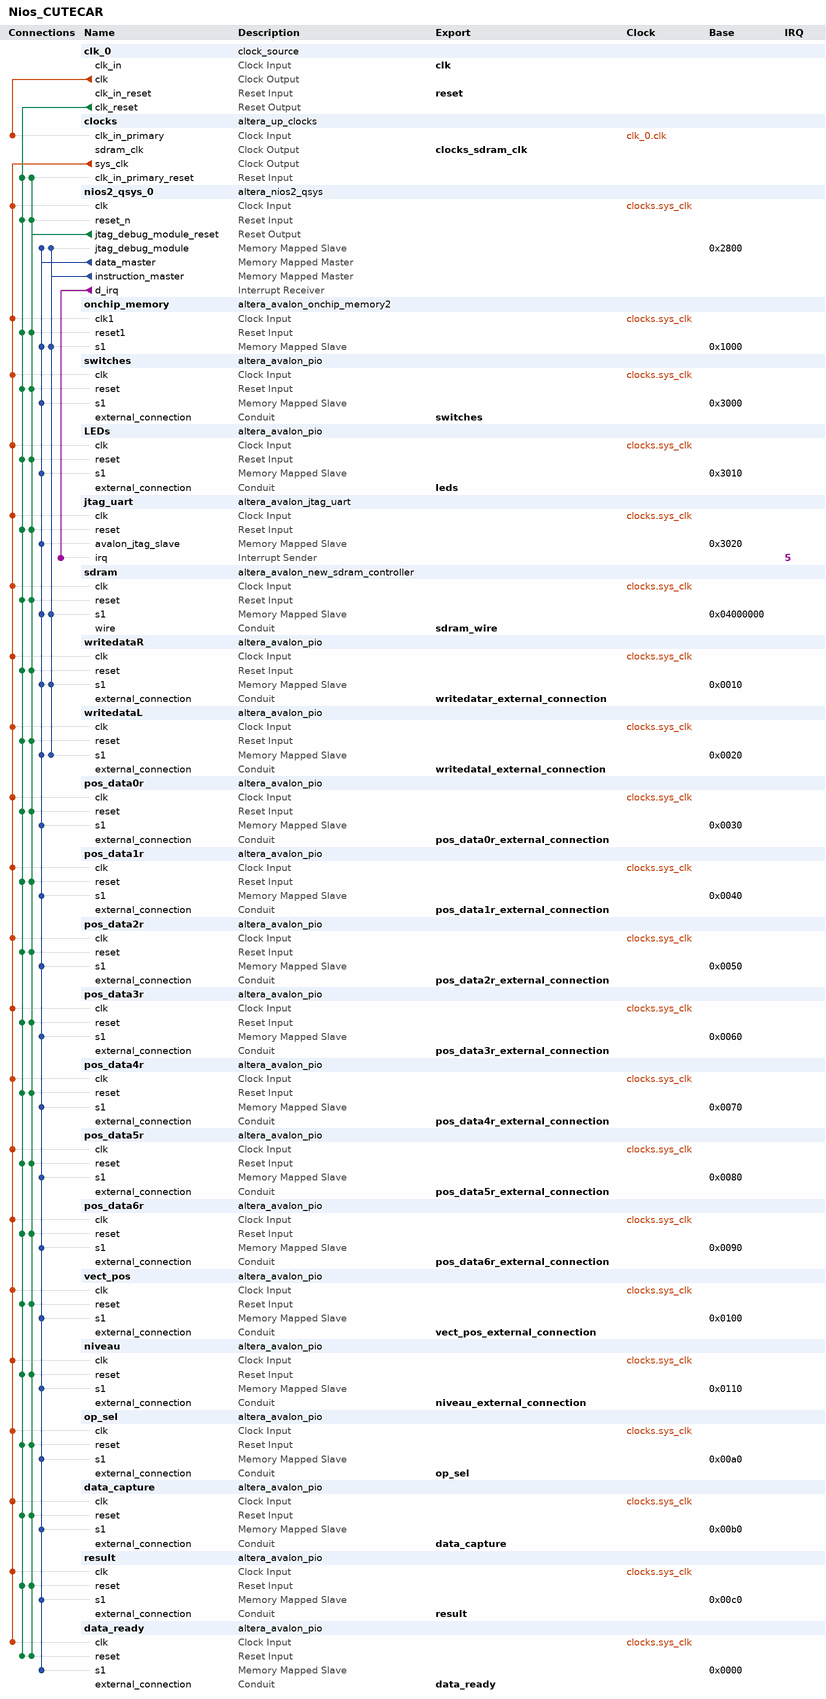
[diagram p0: system contents]
# Platform Designer (Qsys) system Nios_CUTECAR, Cyclone IV E EP4CE22F17C6
# Parameters at their usual value, and those the tool derives, are not listed.
package require -exact qsys 13.0.1.99.2
create_system Nios_CUTECAR
set_project_property DEVICE_FAMILY {Cyclone IV E}
set_project_property DEVICE EP4CE22F17C6

add_instance clk_0 clock_source 13.0
set_instance_parameter_value clk_0 clockFrequency 50000000

add_instance clocks altera_up_clocks 13.0
set_instance_parameter_value clocks board DE0-Nano
set_instance_parameter_value clocks vga_clk false
set_instance_parameter_value clocks audio_clk true
set_instance_parameter_value clocks audio_clk_freq 12.288

add_instance nios2_qsys_0 altera_nios2_qsys 13.0
set_instance_parameter_value nios2_qsys_0 resetSlave sdram.s1
set_instance_parameter_value nios2_qsys_0 mmu_TLBMissExcSlave None
set_instance_parameter_value nios2_qsys_0 exceptionSlave sdram.s1
set_instance_parameter_value nios2_qsys_0 breakSlave nios2_qsys_0.jtag_debug_module
set_instance_parameter_value nios2_qsys_0 impl Tiny
set_instance_parameter_value nios2_qsys_0 icache_size 4096

add_instance onchip_memory altera_avalon_onchip_memory2 13.0.1.99.2
set_instance_parameter_value onchip_memory dataWidth 32
set_instance_parameter_value onchip_memory dualPort false
set_instance_parameter_value onchip_memory initMemContent true
set_instance_parameter_value onchip_memory initializationFileName onchip_mem.hex
set_instance_parameter_value onchip_memory memorySize 4096

add_instance switches altera_avalon_pio 13.0.1.99.2
set_instance_parameter_value switches direction Output
set_instance_parameter_value switches width 8

add_instance LEDs altera_avalon_pio 13.0.1.99.2
set_instance_parameter_value LEDs direction Output
set_instance_parameter_value LEDs width 8

add_instance jtag_uart altera_avalon_jtag_uart 13.0.1.99.2
set_instance_parameter_value jtag_uart simInteractiveOptions NO_INTERACTIVE_WINDOWS

add_instance sdram altera_avalon_new_sdram_controller 13.0.1.99.2
set_instance_parameter_value sdram TAC 5.5
set_instance_parameter_value sdram TRCD 20.0
set_instance_parameter_value sdram TRP 20.0
set_instance_parameter_value sdram casLatency 3
set_instance_parameter_value sdram columnWidth 9
set_instance_parameter_value sdram dataWidth 16
set_instance_parameter_value sdram generateSimulationModel false
set_instance_parameter_value sdram model single_Micron_MT48LC4M32B2_7_chip
set_instance_parameter_value sdram numberOfBanks 4
set_instance_parameter_value sdram numberOfChipSelects 1
set_instance_parameter_value sdram powerUpDelay 100.0
set_instance_parameter_value sdram refreshPeriod 15.625
set_instance_parameter_value sdram rowWidth 13

add_instance writedataR altera_avalon_pio 13.0.1.99.2
set_instance_parameter_value writedataR direction Output
set_instance_parameter_value writedataR width 14

add_instance writedataL altera_avalon_pio 13.0.1.99.2
set_instance_parameter_value writedataL direction Output
set_instance_parameter_value writedataL width 14

add_instance pos_data0r altera_avalon_pio 13.0.1.99.2
set_instance_parameter_value pos_data0r direction Input
set_instance_parameter_value pos_data0r width 8

add_instance pos_data1r altera_avalon_pio 13.0.1.99.2
set_instance_parameter_value pos_data1r direction Input
set_instance_parameter_value pos_data1r width 8

add_instance pos_data2r altera_avalon_pio 13.0.1.99.2
set_instance_parameter_value pos_data2r direction Input
set_instance_parameter_value pos_data2r width 8

add_instance pos_data3r altera_avalon_pio 13.0.1.99.2
set_instance_parameter_value pos_data3r direction Input
set_instance_parameter_value pos_data3r width 8

add_instance pos_data4r altera_avalon_pio 13.0.1.99.2
set_instance_parameter_value pos_data4r direction Input
set_instance_parameter_value pos_data4r width 8

add_instance pos_data5r altera_avalon_pio 13.0.1.99.2
set_instance_parameter_value pos_data5r direction Input
set_instance_parameter_value pos_data5r width 8

add_instance pos_data6r altera_avalon_pio 13.0.1.99.2
set_instance_parameter_value pos_data6r direction Input
set_instance_parameter_value pos_data6r width 8

add_instance vect_pos altera_avalon_pio 13.0.1.99.2
set_instance_parameter_value vect_pos direction Input
set_instance_parameter_value vect_pos width 7

add_instance niveau altera_avalon_pio 13.0.1.99.2
set_instance_parameter_value niveau direction Output
set_instance_parameter_value niveau width 8

add_instance op_sel altera_avalon_pio 13.0.1.99.2
set_instance_parameter_value op_sel direction Output
set_instance_parameter_value op_sel width 2

add_instance data_capture altera_avalon_pio 13.0.1.99.2
set_instance_parameter_value data_capture direction Output
set_instance_parameter_value data_capture width 1

add_instance result altera_avalon_pio 13.0.1.99.2
set_instance_parameter_value result direction Input
set_instance_parameter_value result width 16

add_instance data_ready altera_avalon_pio 13.0.1.99.2
set_instance_parameter_value data_ready direction Input
set_instance_parameter_value data_ready width 1

# connections
add_connection clk_0.clk clocks.clk_in_primary clock
add_connection clocks.sys_clk data_capture.clk clock
add_connection clocks.sys_clk data_ready.clk clock
add_connection clocks.sys_clk jtag_uart.clk clock
add_connection clocks.sys_clk LEDs.clk clock
add_connection clocks.sys_clk nios2_qsys_0.clk clock
add_connection clocks.sys_clk niveau.clk clock
add_connection clocks.sys_clk onchip_memory.clk1 clock
add_connection clocks.sys_clk op_sel.clk clock
add_connection clocks.sys_clk pos_data0r.clk clock
add_connection clocks.sys_clk pos_data1r.clk clock
add_connection clocks.sys_clk pos_data2r.clk clock
add_connection clocks.sys_clk pos_data3r.clk clock
add_connection clocks.sys_clk pos_data4r.clk clock
add_connection clocks.sys_clk pos_data5r.clk clock
add_connection clocks.sys_clk pos_data6r.clk clock
add_connection clocks.sys_clk result.clk clock
add_connection clocks.sys_clk sdram.clk clock
add_connection clocks.sys_clk switches.clk clock
add_connection clocks.sys_clk vect_pos.clk clock
add_connection clocks.sys_clk writedataL.clk clock
add_connection clocks.sys_clk writedataR.clk clock
add_connection clk_0.clk_reset clocks.clk_in_primary_reset reset
add_connection clk_0.clk_reset data_capture.reset reset
add_connection clk_0.clk_reset data_ready.reset reset
add_connection clk_0.clk_reset jtag_uart.reset reset
add_connection clk_0.clk_reset LEDs.reset reset
add_connection clk_0.clk_reset nios2_qsys_0.reset_n reset
add_connection clk_0.clk_reset niveau.reset reset
add_connection clk_0.clk_reset onchip_memory.reset1 reset
add_connection clk_0.clk_reset op_sel.reset reset
add_connection clk_0.clk_reset pos_data0r.reset reset
add_connection clk_0.clk_reset pos_data1r.reset reset
add_connection clk_0.clk_reset pos_data2r.reset reset
add_connection clk_0.clk_reset pos_data3r.reset reset
add_connection clk_0.clk_reset pos_data4r.reset reset
add_connection clk_0.clk_reset pos_data5r.reset reset
add_connection clk_0.clk_reset pos_data6r.reset reset
add_connection clk_0.clk_reset result.reset reset
add_connection clk_0.clk_reset sdram.reset reset
add_connection clk_0.clk_reset switches.reset reset
add_connection clk_0.clk_reset vect_pos.reset reset
add_connection clk_0.clk_reset writedataL.reset reset
add_connection clk_0.clk_reset writedataR.reset reset
add_connection nios2_qsys_0.jtag_debug_module_reset clocks.clk_in_primary_reset reset
add_connection nios2_qsys_0.jtag_debug_module_reset data_capture.reset reset
add_connection nios2_qsys_0.jtag_debug_module_reset data_ready.reset reset
add_connection nios2_qsys_0.jtag_debug_module_reset jtag_uart.reset reset
add_connection nios2_qsys_0.jtag_debug_module_reset LEDs.reset reset
add_connection nios2_qsys_0.jtag_debug_module_reset nios2_qsys_0.reset_n reset
add_connection nios2_qsys_0.jtag_debug_module_reset niveau.reset reset
add_connection nios2_qsys_0.jtag_debug_module_reset onchip_memory.reset1 reset
add_connection nios2_qsys_0.jtag_debug_module_reset op_sel.reset reset
add_connection nios2_qsys_0.jtag_debug_module_reset pos_data0r.reset reset
add_connection nios2_qsys_0.jtag_debug_module_reset pos_data1r.reset reset
add_connection nios2_qsys_0.jtag_debug_module_reset pos_data2r.reset reset
add_connection nios2_qsys_0.jtag_debug_module_reset pos_data3r.reset reset
add_connection nios2_qsys_0.jtag_debug_module_reset pos_data4r.reset reset
add_connection nios2_qsys_0.jtag_debug_module_reset pos_data5r.reset reset
add_connection nios2_qsys_0.jtag_debug_module_reset pos_data6r.reset reset
add_connection nios2_qsys_0.jtag_debug_module_reset result.reset reset
add_connection nios2_qsys_0.jtag_debug_module_reset sdram.reset reset
add_connection nios2_qsys_0.jtag_debug_module_reset switches.reset reset
add_connection nios2_qsys_0.jtag_debug_module_reset vect_pos.reset reset
add_connection nios2_qsys_0.jtag_debug_module_reset writedataL.reset reset
add_connection nios2_qsys_0.jtag_debug_module_reset writedataR.reset reset
add_connection nios2_qsys_0.data_master data_capture.s1 avalon
set_connection_parameter_value nios2_qsys_0.data_master/data_capture.s1 baseAddress 0x00b0
add_connection nios2_qsys_0.data_master data_ready.s1 avalon
set_connection_parameter_value nios2_qsys_0.data_master/data_ready.s1 baseAddress 0x0000
add_connection nios2_qsys_0.data_master jtag_uart.avalon_jtag_slave avalon
set_connection_parameter_value nios2_qsys_0.data_master/jtag_uart.avalon_jtag_slave baseAddress 0x3020
add_connection nios2_qsys_0.data_master LEDs.s1 avalon
set_connection_parameter_value nios2_qsys_0.data_master/LEDs.s1 baseAddress 0x3010
add_connection nios2_qsys_0.data_master nios2_qsys_0.jtag_debug_module avalon
set_connection_parameter_value nios2_qsys_0.data_master/nios2_qsys_0.jtag_debug_module baseAddress 0x2800
add_connection nios2_qsys_0.data_master niveau.s1 avalon
set_connection_parameter_value nios2_qsys_0.data_master/niveau.s1 baseAddress 0x0110
add_connection nios2_qsys_0.data_master onchip_memory.s1 avalon
set_connection_parameter_value nios2_qsys_0.data_master/onchip_memory.s1 baseAddress 0x1000
add_connection nios2_qsys_0.data_master op_sel.s1 avalon
set_connection_parameter_value nios2_qsys_0.data_master/op_sel.s1 baseAddress 0x00a0
add_connection nios2_qsys_0.data_master pos_data0r.s1 avalon
set_connection_parameter_value nios2_qsys_0.data_master/pos_data0r.s1 baseAddress 0x0030
add_connection nios2_qsys_0.data_master pos_data1r.s1 avalon
set_connection_parameter_value nios2_qsys_0.data_master/pos_data1r.s1 baseAddress 0x0040
add_connection nios2_qsys_0.data_master pos_data2r.s1 avalon
set_connection_parameter_value nios2_qsys_0.data_master/pos_data2r.s1 baseAddress 0x0050
add_connection nios2_qsys_0.data_master pos_data3r.s1 avalon
set_connection_parameter_value nios2_qsys_0.data_master/pos_data3r.s1 baseAddress 0x0060
add_connection nios2_qsys_0.data_master pos_data4r.s1 avalon
set_connection_parameter_value nios2_qsys_0.data_master/pos_data4r.s1 baseAddress 0x0070
add_connection nios2_qsys_0.data_master pos_data5r.s1 avalon
set_connection_parameter_value nios2_qsys_0.data_master/pos_data5r.s1 baseAddress 0x0080
add_connection nios2_qsys_0.data_master pos_data6r.s1 avalon
set_connection_parameter_value nios2_qsys_0.data_master/pos_data6r.s1 baseAddress 0x0090
add_connection nios2_qsys_0.data_master result.s1 avalon
set_connection_parameter_value nios2_qsys_0.data_master/result.s1 baseAddress 0x00c0
add_connection nios2_qsys_0.data_master sdram.s1 avalon
set_connection_parameter_value nios2_qsys_0.data_master/sdram.s1 baseAddress 0x04000000
add_connection nios2_qsys_0.data_master switches.s1 avalon
set_connection_parameter_value nios2_qsys_0.data_master/switches.s1 baseAddress 0x3000
add_connection nios2_qsys_0.data_master vect_pos.s1 avalon
set_connection_parameter_value nios2_qsys_0.data_master/vect_pos.s1 baseAddress 0x0100
add_connection nios2_qsys_0.data_master writedataL.s1 avalon
set_connection_parameter_value nios2_qsys_0.data_master/writedataL.s1 baseAddress 0x0020
add_connection nios2_qsys_0.data_master writedataR.s1 avalon
set_connection_parameter_value nios2_qsys_0.data_master/writedataR.s1 baseAddress 0x0010
add_connection nios2_qsys_0.instruction_master nios2_qsys_0.jtag_debug_module avalon
set_connection_parameter_value nios2_qsys_0.instruction_master/nios2_qsys_0.jtag_debug_module baseAddress 0x2800
add_connection nios2_qsys_0.instruction_master onchip_memory.s1 avalon
set_connection_parameter_value nios2_qsys_0.instruction_master/onchip_memory.s1 baseAddress 0x1000
add_connection nios2_qsys_0.instruction_master sdram.s1 avalon
set_connection_parameter_value nios2_qsys_0.instruction_master/sdram.s1 baseAddress 0x04000000
add_connection nios2_qsys_0.instruction_master writedataL.s1 avalon
set_connection_parameter_value nios2_qsys_0.instruction_master/writedataL.s1 baseAddress 0x0020
add_connection nios2_qsys_0.instruction_master writedataR.s1 avalon
set_connection_parameter_value nios2_qsys_0.instruction_master/writedataR.s1 baseAddress 0x0010
add_connection nios2_qsys_0.d_irq jtag_uart.irq interrupt
set_connection_parameter_value nios2_qsys_0.d_irq/jtag_uart.irq irqNumber 5

# exported interfaces
add_interface clk clock sink
set_interface_property clk EXPORT_OF clk_0.clk_in
add_interface switches conduit end
set_interface_property switches EXPORT_OF switches.external_connection
add_interface leds conduit end
set_interface_property leds EXPORT_OF LEDs.external_connection
add_interface sdram_wire conduit end
set_interface_property sdram_wire EXPORT_OF sdram.wire
add_interface reset reset sink
set_interface_property reset EXPORT_OF clk_0.clk_in_reset
add_interface writedatal_external_connection conduit end
set_interface_property writedatal_external_connection EXPORT_OF writedataL.external_connection
add_interface writedatar_external_connection conduit end
set_interface_property writedatar_external_connection EXPORT_OF writedataR.external_connection
add_interface clocks_sdram_clk clock source
set_interface_property clocks_sdram_clk EXPORT_OF clocks.sdram_clk
add_interface pos_data0r_external_connection conduit end
set_interface_property pos_data0r_external_connection EXPORT_OF pos_data0r.external_connection
add_interface pos_data1r_external_connection conduit end
set_interface_property pos_data1r_external_connection EXPORT_OF pos_data1r.external_connection
add_interface pos_data2r_external_connection conduit end
set_interface_property pos_data2r_external_connection EXPORT_OF pos_data2r.external_connection
add_interface pos_data4r_external_connection conduit end
set_interface_property pos_data4r_external_connection EXPORT_OF pos_data4r.external_connection
add_interface pos_data5r_external_connection conduit end
set_interface_property pos_data5r_external_connection EXPORT_OF pos_data5r.external_connection
add_interface pos_data6r_external_connection conduit end
set_interface_property pos_data6r_external_connection EXPORT_OF pos_data6r.external_connection
add_interface pos_data3r_external_connection conduit end
set_interface_property pos_data3r_external_connection EXPORT_OF pos_data3r.external_connection
add_interface vect_pos_external_connection conduit end
set_interface_property vect_pos_external_connection EXPORT_OF vect_pos.external_connection
add_interface niveau_external_connection conduit end
set_interface_property niveau_external_connection EXPORT_OF niveau.external_connection
add_interface op_sel conduit end
set_interface_property op_sel EXPORT_OF op_sel.external_connection
add_interface data_capture conduit end
set_interface_property data_capture EXPORT_OF data_capture.external_connection
add_interface result conduit end
set_interface_property result EXPORT_OF result.external_connection
add_interface data_ready conduit end
set_interface_property data_ready EXPORT_OF data_ready.external_connection

set_interconnect_requirement {$system} qsys_mm.clockCrossingAdapter HANDSHAKE
set_interconnect_requirement {$system} qsys_mm.maxAdditionalLatency 1

save_system Nios_CUTECAR.qsys
